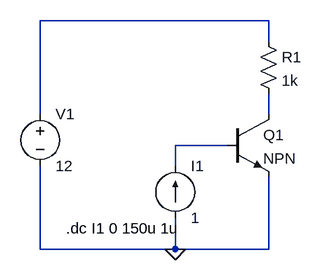
[diagram p0: schematic ex3b.asc]
ex3b.asc, the LTspice schematic file:
Version 4
SHEET 1 880 680
WIRE 224 -16 -128 -16
WIRE 224 16 224 -16
WIRE -128 128 -128 -16
WIRE 224 128 224 96
WIRE 160 176 80 176
WIRE 80 208 80 176
WIRE -128 336 -128 208
WIRE 80 336 80 288
WIRE 80 336 -128 336
WIRE 224 336 224 224
WIRE 224 336 80 336
FLAG 80 336 0
SYMBOL res 208 0 R0
SYMATTR InstName R1
SYMATTR Value 1k
SYMBOL voltage -128 112 R0
WINDOW 123 0 0 Left 2
WINDOW 39 0 0 Left 2
SYMATTR InstName V1
SYMATTR Value 12
SYMBOL npn 160 128 R0
SYMATTR InstName Q1
SYMBOL current 80 288 M180
WINDOW 0 24 80 Left 2
WINDOW 3 24 0 Left 2
WINDOW 123 0 0 Left 2
WINDOW 39 0 0 Left 2
SYMATTR InstName I1
SYMATTR Value 1
TEXT -88 304 Left 2 !.dc I1 0 150u 1u

The netlist it stands for:
* ex3b.asc
R1 N001 N002 1k
V1 N001 0 12
Q1 N002 N003 0 0 NPN
I1 0 N003 1
.model NPN NPN
.model PNP PNP
.lib standard.bjt
.dc I1 0 150u 1u
.backanno
.end